# Altium project Arcadinator.PrjPcb
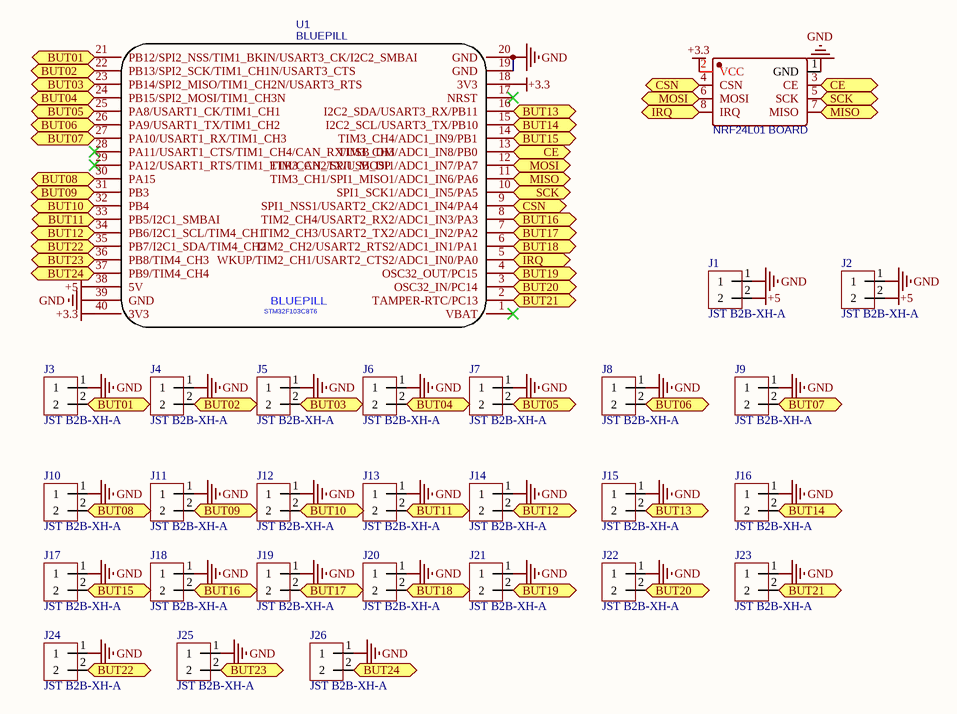
[diagram p0: Arcadinator.SchDoc]
1 sheet, 28 parts. Net scope: flat (ports and power ports of the same name join across sheets).
Board file: Arcadinator.PcbDoc

## Sheet Arcadinator.SchDoc
size A4; SheetNumber: 1; SheetTotal: 1

### Parts
J1  JST B2B-XH-A  [JST XH B2B-XH-A]
J2  JST B2B-XH-A  [JST XH B2B-XH-A]
J3  JST B2B-XH-A  [JST XH B2B-XH-A]
J4  JST B2B-XH-A  [JST XH B2B-XH-A]
J5  JST B2B-XH-A  [JST XH B2B-XH-A]
J6  JST B2B-XH-A  [JST XH B2B-XH-A]
J7  JST B2B-XH-A  [JST XH B2B-XH-A]
J8  JST B2B-XH-A  [JST XH B2B-XH-A]
J9  JST B2B-XH-A  [JST XH B2B-XH-A]
J10  JST B2B-XH-A  [JST XH B2B-XH-A]
J11  JST B2B-XH-A  [JST XH B2B-XH-A]
J12  JST B2B-XH-A  [JST XH B2B-XH-A]
J13  JST B2B-XH-A  [JST XH B2B-XH-A]
J14  JST B2B-XH-A  [JST XH B2B-XH-A]
J15  JST B2B-XH-A  [JST XH B2B-XH-A]
J16  JST B2B-XH-A  [JST XH B2B-XH-A]
J17  JST B2B-XH-A  [JST XH B2B-XH-A]
J18  JST B2B-XH-A  [JST XH B2B-XH-A]
J19  JST B2B-XH-A  [JST XH B2B-XH-A]
J20  JST B2B-XH-A  [JST XH B2B-XH-A]
J21  JST B2B-XH-A  [JST XH B2B-XH-A]
J22  JST B2B-XH-A  [JST XH B2B-XH-A]
J23  JST B2B-XH-A  [JST XH B2B-XH-A]
J24  JST B2B-XH-A  [JST XH B2B-XH-A]
J25  JST B2B-XH-A  [JST XH B2B-XH-A]
J26  JST B2B-XH-A  [JST XH B2B-XH-A]
MK1  NRF24L01 BOARD  [WIRELM-SMD_AI_NRF24L01]
U1  BLUEPILL  [BLUEPILL]

### Ports
BUT01 (bidir), BUT02 (bidir), BUT03 (bidir), BUT04 (bidir), BUT05 (bidir), BUT06 (bidir), BUT07 (bidir), BUT08 (bidir), BUT09 (bidir), BUT10 (bidir), BUT11 (bidir), BUT12 (bidir), BUT13 (bidir), BUT14 (bidir), BUT15 (bidir), BUT16 (bidir), BUT17 (bidir), BUT18 (bidir), BUT19 (bidir), BUT20 (bidir), BUT21 (bidir), BUT22 (bidir), BUT23 (bidir), BUT24 (bidir), CE (bidir), CSN (bidir), IRQ (bidir), MISO (bidir), MOSI (bidir), SCK (bidir)

### Nets
+3.3: MK1.2(VCC) U1.18(3V3) U1.40(3V3)
+5: J1.2 J2.2 U1.38(5V)
GND: J1.1 J2.1 J3.1 J4.1 J5.1 J6.1 J7.1 J8.1 J9.1 J10.1 J11.1 J12.1 J13.1 J14.1 J15.1 J16.1 J17.1 J18.1 J19.1 J20.1 J21.1 J22.1 J23.1 J24.1 J25.1 J26.1 MK1.1(GND) U1.19(GND) U1.20(GND) U1.39(GND)
BUT01: J3.2 U1.21(PB12/SPI2_NSS/TIM1_BKIN/USART3_CK/I2C2_SMBAI) ; port BUT01
BUT02: J4.2 U1.22(PB13/SPI2_SCK/TIM1_CH1N/USART3_CTS) ; port BUT02
BUT03: J5.2 U1.23(PB14/SPI2_MISO/TIM1_CH2N/USART3_RTS) ; port BUT03
BUT04: J6.2 U1.24(PB15/SPI2_MOSI/TIM1_CH3N) ; port BUT04
BUT05: J7.2 U1.25(PA8/USART1_CK/TIM1_CH1) ; port BUT05
BUT06: J8.2 U1.26(PA9/USART1_TX/TIM1_CH2) ; port BUT06
BUT07: J9.2 U1.27(PA10/USART1_RX/TIM1_CH3) ; port BUT07
BUT08: J10.2 U1.30(PA15) ; port BUT08
BUT09: J11.2 U1.31(PB3) ; port BUT09
BUT10: J12.2 U1.32(PB4) ; port BUT10
BUT11: J13.2 U1.33(PB5/I2C1_SMBAI) ; port BUT11
BUT12: J14.2 U1.34(PB6/I2C1_SCL/TIM4_CH1) ; port BUT12
BUT13: J15.2 U1.16(I2C2_SDA/USART3_RX/PB11) ; port BUT13
BUT14: J16.2 U1.15(I2C2_SCL/USART3_TX/PB10) ; port BUT14
BUT15: J17.2 U1.14(TIM3_CH4/ADC1_IN9/PB1) ; port BUT15
BUT16: J18.2 U1.8(TIM2_CH4/USART2_RX2/ADC1_IN3/PA3) ; port BUT16
BUT17: J19.2 U1.7(TIM2_CH3/USART2_TX2/ADC1_IN2/PA2) ; port BUT17
BUT18: J20.2 U1.6(TIM2_CH2/USART2_RTS2/ADC1_IN1/PA1) ; port BUT18
BUT19: J21.2 U1.4(OSC32_OUT/PC15) ; port BUT19
BUT20: J22.2 U1.3(OSC32_IN/PC14) ; port BUT20
BUT21: J23.2 U1.2(TAMPER-RTC/PC13) ; port BUT21
BUT22: J24.2 U1.35(PB7/I2C1_SDA/TIM4_CH2) ; port BUT22
BUT23: J25.2 U1.36(PB8/TIM4_CH3) ; port BUT23
BUT24: J26.2 U1.37(PB9/TIM4_CH4) ; port BUT24
CE: MK1.3(CE) U1.13(TIM3_CH3/ADC1_IN8/PB0) ; port CE
CSN: MK1.4(CSN) U1.9(SPI1_NSS1/USART2_CK2/ADC1_IN4/PA4) ; port CSN
IRQ: MK1.8(IRQ) U1.5(WKUP/TIM2_CH1/USART2_CTS2/ADC1_IN0/PA0) ; port IRQ
MISO: MK1.7(MISO) U1.11(TIM3_CH1/SPI1_MISO1/ADC1_IN6/PA6) ; port MISO
MOSI: MK1.6(MOSI) U1.12(TIM3_CH2/SPI1_MOSI1/ADC1_IN7/PA7) ; port MOSI
SCK: MK1.5(SCK) U1.10(SPI1_SCK1/ADC1_IN5/PA5) ; port SCK

Not connected (* = marked no-connect by the designer): U1 1(VBAT)* 17(NRST)* 28(PA11/USART1_CTS/TIM1_CH4/CAN_RX/USB_DM)* 29(PA12/USART1_RTS/TIM1_ETR/CAN_TX/USB_DP)*

### Notes on the sheet
- (in symbol BLUEPILL) STM32F103C8T6

### Library data of the parts
J1-J26 = JST B2B-XH-A: 2,54 mm JST-XH Connector, 2 Pins
MK1 = NRF24L01 BOARD: BOM_Manufacturer: Ai-Thinker(安信可); BOM_Manufacturer Part: NF-04; BOM_Supplier: LCSC; BOM_Supplier Part: C90751; BOM_JLCPCB Part Class: Extended Part; spicePre: M; spiceSymbolName: NRF24L01 BOARD
U1 = BLUEPILL: Contributor: rom1nux; BOM_Supplier Part: undefined; spicePre: U; spiceSymbolName: BLUEPILL